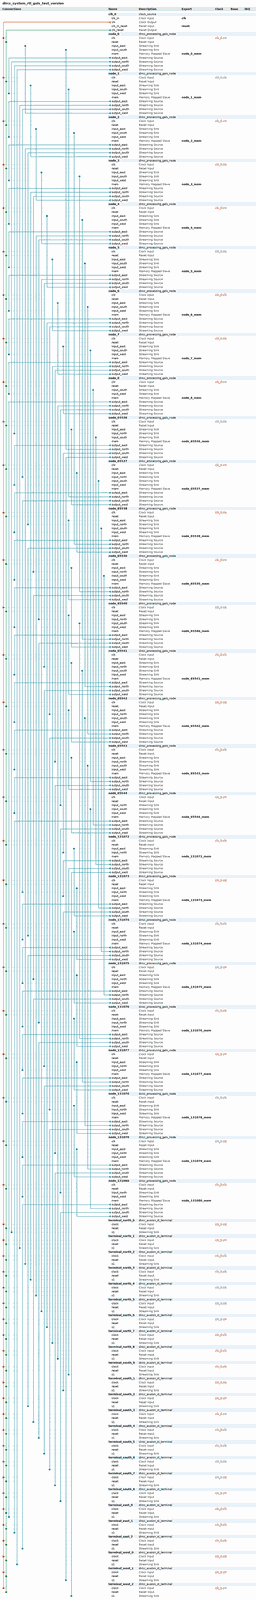
[diagram p0: system contents, whole]
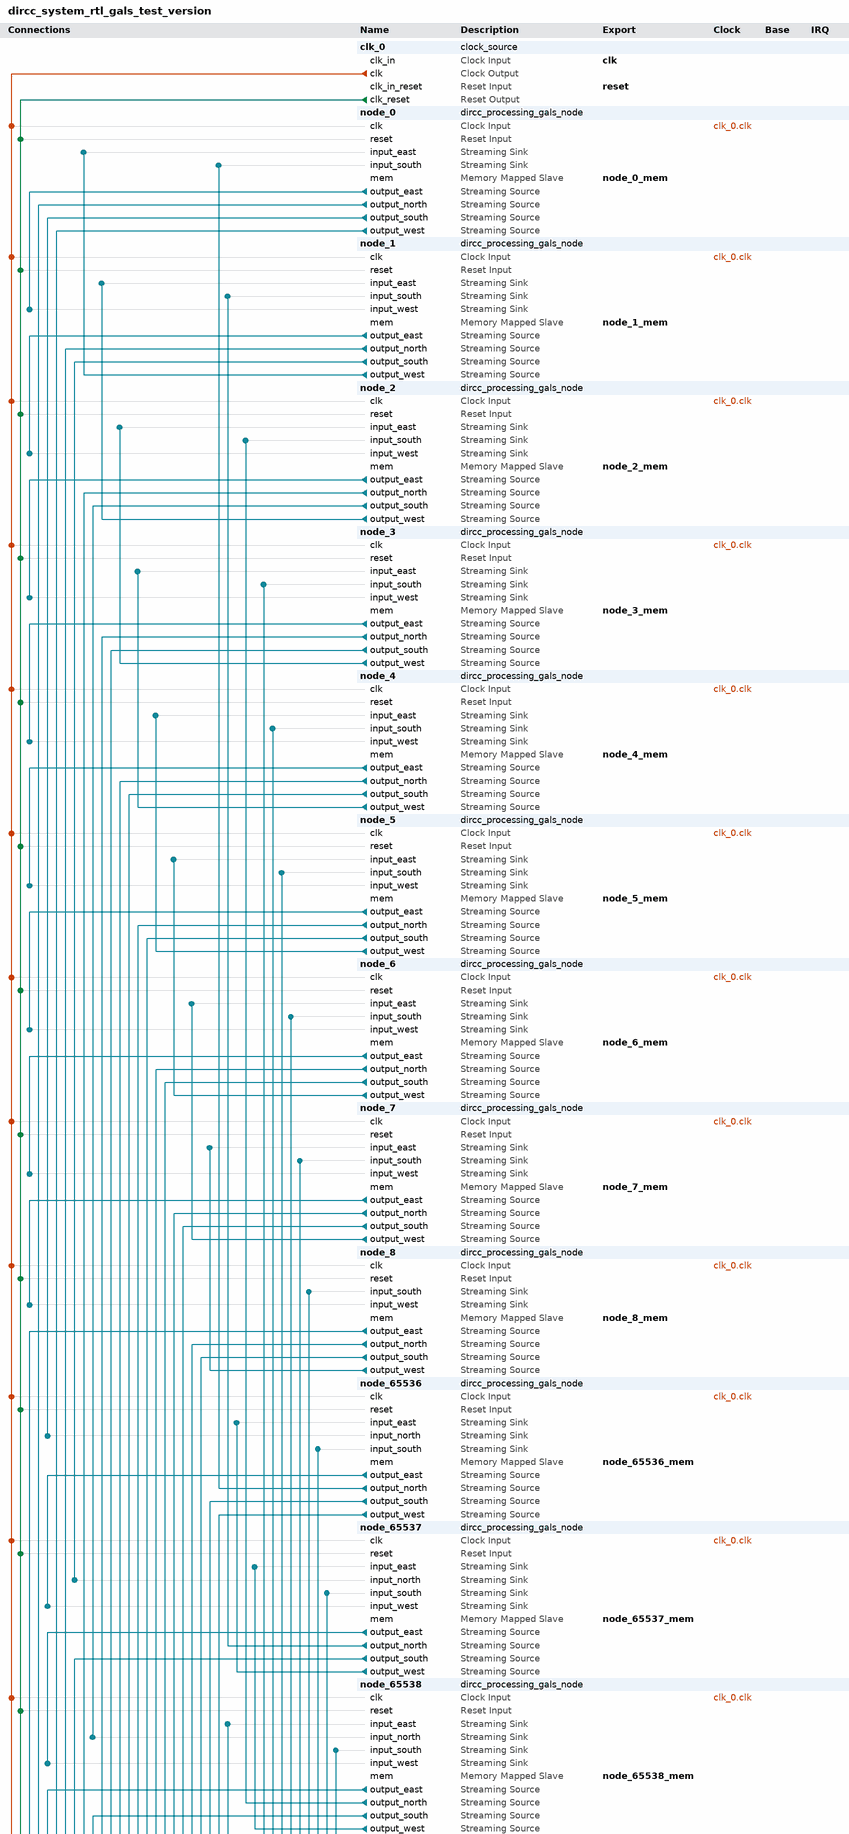
[diagram p1: system contents, upper part]
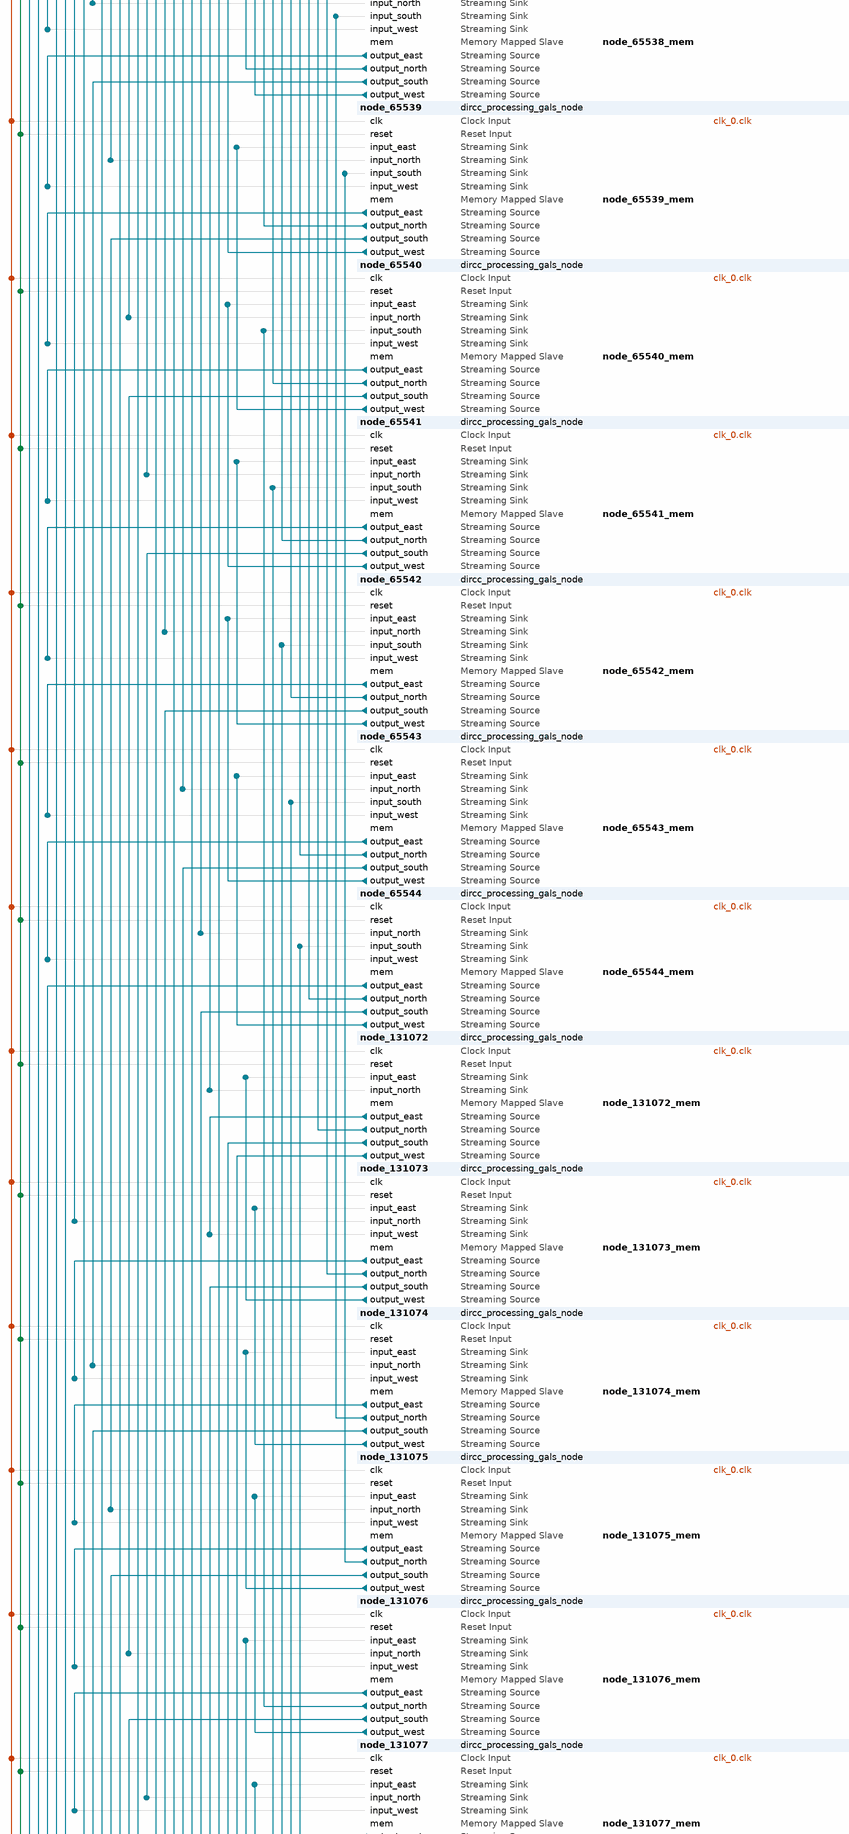
[diagram p2: system contents, middle part]
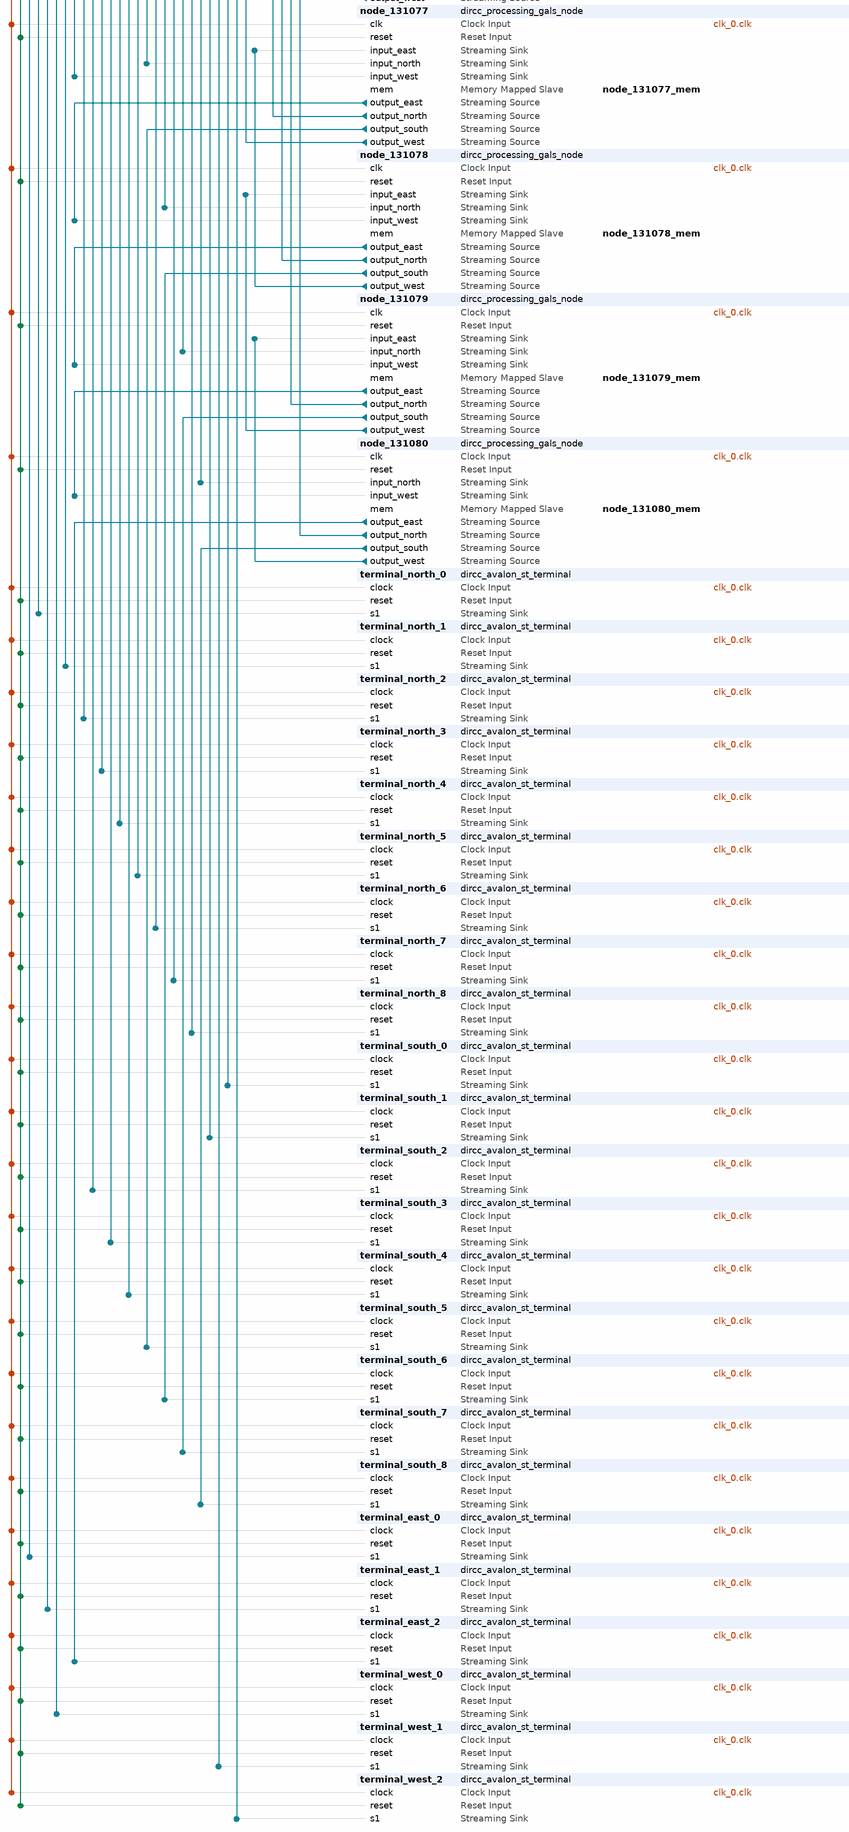
[diagram p3: system contents, lower part]
# Platform Designer (Qsys) system dircc_system_rtl_gals_test_version, Cyclone V 5CSEMA5F31C6
# Parameters at their usual value, and those the tool derives, are not listed.
package require -exact qsys 16.1
create_system dircc_system_rtl_gals_test_version
set_project_property DEVICE_FAMILY {Cyclone V}
set_project_property DEVICE 5CSEMA5F31C6

add_instance clk_0 clock_source 16.1
set_instance_parameter_value clk_0 clockFrequency 50000000

add_instance node_0 dircc_processing_gals_node 1.0
set_instance_parameter_value node_0 ADDRESS 0

add_instance node_1 dircc_processing_gals_node 1.0
set_instance_parameter_value node_1 ADDRESS 1

add_instance node_2 dircc_processing_gals_node 1.0
set_instance_parameter_value node_2 ADDRESS 2

add_instance node_3 dircc_processing_gals_node 1.0
set_instance_parameter_value node_3 ADDRESS 3

add_instance node_4 dircc_processing_gals_node 1.0
set_instance_parameter_value node_4 ADDRESS 4

add_instance node_5 dircc_processing_gals_node 1.0
set_instance_parameter_value node_5 ADDRESS 5

add_instance node_6 dircc_processing_gals_node 1.0
set_instance_parameter_value node_6 ADDRESS 6

add_instance node_7 dircc_processing_gals_node 1.0
set_instance_parameter_value node_7 ADDRESS 7

add_instance node_8 dircc_processing_gals_node 1.0
set_instance_parameter_value node_8 ADDRESS 8

add_instance node_65536 dircc_processing_gals_node 1.0
set_instance_parameter_value node_65536 ADDRESS 65536

add_instance node_65537 dircc_processing_gals_node 1.0
set_instance_parameter_value node_65537 ADDRESS 65537

add_instance node_65538 dircc_processing_gals_node 1.0
set_instance_parameter_value node_65538 ADDRESS 65538

add_instance node_65539 dircc_processing_gals_node 1.0
set_instance_parameter_value node_65539 ADDRESS 65539

add_instance node_65540 dircc_processing_gals_node 1.0
set_instance_parameter_value node_65540 ADDRESS 65540

add_instance node_65541 dircc_processing_gals_node 1.0
set_instance_parameter_value node_65541 ADDRESS 65541

add_instance node_65542 dircc_processing_gals_node 1.0
set_instance_parameter_value node_65542 ADDRESS 65542

add_instance node_65543 dircc_processing_gals_node 1.0
set_instance_parameter_value node_65543 ADDRESS 65543

add_instance node_65544 dircc_processing_gals_node 1.0
set_instance_parameter_value node_65544 ADDRESS 65544

add_instance node_131072 dircc_processing_gals_node 1.0
set_instance_parameter_value node_131072 ADDRESS 131072

add_instance node_131073 dircc_processing_gals_node 1.0
set_instance_parameter_value node_131073 ADDRESS 131073

add_instance node_131074 dircc_processing_gals_node 1.0
set_instance_parameter_value node_131074 ADDRESS 131074

add_instance node_131075 dircc_processing_gals_node 1.0
set_instance_parameter_value node_131075 ADDRESS 131075

add_instance node_131076 dircc_processing_gals_node 1.0
set_instance_parameter_value node_131076 ADDRESS 131076

add_instance node_131077 dircc_processing_gals_node 1.0
set_instance_parameter_value node_131077 ADDRESS 131077

add_instance node_131078 dircc_processing_gals_node 1.0
set_instance_parameter_value node_131078 ADDRESS 131078

add_instance node_131079 dircc_processing_gals_node 1.0
set_instance_parameter_value node_131079 ADDRESS 131079

add_instance node_131080 dircc_processing_gals_node 1.0
set_instance_parameter_value node_131080 ADDRESS 131080

add_instance terminal_north_0 dircc_avalon_st_terminal 1.0
set_instance_parameter_value terminal_north_0 DATA_WIDTH 32

add_instance terminal_north_1 dircc_avalon_st_terminal 1.0
set_instance_parameter_value terminal_north_1 DATA_WIDTH 32

add_instance terminal_north_2 dircc_avalon_st_terminal 1.0
set_instance_parameter_value terminal_north_2 DATA_WIDTH 32

add_instance terminal_north_3 dircc_avalon_st_terminal 1.0
set_instance_parameter_value terminal_north_3 DATA_WIDTH 32

add_instance terminal_north_4 dircc_avalon_st_terminal 1.0
set_instance_parameter_value terminal_north_4 DATA_WIDTH 32

add_instance terminal_north_5 dircc_avalon_st_terminal 1.0
set_instance_parameter_value terminal_north_5 DATA_WIDTH 32

add_instance terminal_north_6 dircc_avalon_st_terminal 1.0
set_instance_parameter_value terminal_north_6 DATA_WIDTH 32

add_instance terminal_north_7 dircc_avalon_st_terminal 1.0
set_instance_parameter_value terminal_north_7 DATA_WIDTH 32

add_instance terminal_north_8 dircc_avalon_st_terminal 1.0
set_instance_parameter_value terminal_north_8 DATA_WIDTH 32

add_instance terminal_south_0 dircc_avalon_st_terminal 1.0
set_instance_parameter_value terminal_south_0 DATA_WIDTH 32

add_instance terminal_south_1 dircc_avalon_st_terminal 1.0
set_instance_parameter_value terminal_south_1 DATA_WIDTH 32

add_instance terminal_south_2 dircc_avalon_st_terminal 1.0
set_instance_parameter_value terminal_south_2 DATA_WIDTH 32

add_instance terminal_south_3 dircc_avalon_st_terminal 1.0
set_instance_parameter_value terminal_south_3 DATA_WIDTH 32

add_instance terminal_south_4 dircc_avalon_st_terminal 1.0
set_instance_parameter_value terminal_south_4 DATA_WIDTH 32

add_instance terminal_south_5 dircc_avalon_st_terminal 1.0
set_instance_parameter_value terminal_south_5 DATA_WIDTH 32

add_instance terminal_south_6 dircc_avalon_st_terminal 1.0
set_instance_parameter_value terminal_south_6 DATA_WIDTH 32

add_instance terminal_south_7 dircc_avalon_st_terminal 1.0
set_instance_parameter_value terminal_south_7 DATA_WIDTH 32

add_instance terminal_south_8 dircc_avalon_st_terminal 1.0
set_instance_parameter_value terminal_south_8 DATA_WIDTH 32

add_instance terminal_east_0 dircc_avalon_st_terminal 1.0
set_instance_parameter_value terminal_east_0 DATA_WIDTH 32

add_instance terminal_east_1 dircc_avalon_st_terminal 1.0
set_instance_parameter_value terminal_east_1 DATA_WIDTH 32

add_instance terminal_east_2 dircc_avalon_st_terminal 1.0
set_instance_parameter_value terminal_east_2 DATA_WIDTH 32

add_instance terminal_west_0 dircc_avalon_st_terminal 1.0
set_instance_parameter_value terminal_west_0 DATA_WIDTH 32

add_instance terminal_west_1 dircc_avalon_st_terminal 1.0
set_instance_parameter_value terminal_west_1 DATA_WIDTH 32

add_instance terminal_west_2 dircc_avalon_st_terminal 1.0
set_instance_parameter_value terminal_west_2 DATA_WIDTH 32

# connections
add_connection clk_0.clk node_0.clk clock
add_connection clk_0.clk node_1.clk clock
add_connection clk_0.clk node_2.clk clock
add_connection clk_0.clk node_3.clk clock
add_connection clk_0.clk node_4.clk clock
add_connection clk_0.clk node_5.clk clock
add_connection clk_0.clk node_6.clk clock
add_connection clk_0.clk node_7.clk clock
add_connection clk_0.clk node_8.clk clock
add_connection clk_0.clk node_65536.clk clock
add_connection clk_0.clk node_65537.clk clock
add_connection clk_0.clk node_65538.clk clock
add_connection clk_0.clk node_65539.clk clock
add_connection clk_0.clk node_65540.clk clock
add_connection clk_0.clk node_65541.clk clock
add_connection clk_0.clk node_65542.clk clock
add_connection clk_0.clk node_65543.clk clock
add_connection clk_0.clk node_65544.clk clock
add_connection clk_0.clk node_131072.clk clock
add_connection clk_0.clk node_131073.clk clock
add_connection clk_0.clk node_131074.clk clock
add_connection clk_0.clk node_131075.clk clock
add_connection clk_0.clk node_131076.clk clock
add_connection clk_0.clk node_131077.clk clock
add_connection clk_0.clk node_131078.clk clock
add_connection clk_0.clk node_131079.clk clock
add_connection clk_0.clk node_131080.clk clock
add_connection clk_0.clk terminal_east_0.clock clock
add_connection clk_0.clk terminal_east_1.clock clock
add_connection clk_0.clk terminal_east_2.clock clock
add_connection clk_0.clk terminal_north_0.clock clock
add_connection clk_0.clk terminal_north_1.clock clock
add_connection clk_0.clk terminal_north_2.clock clock
add_connection clk_0.clk terminal_north_3.clock clock
add_connection clk_0.clk terminal_north_4.clock clock
add_connection clk_0.clk terminal_north_5.clock clock
add_connection clk_0.clk terminal_north_6.clock clock
add_connection clk_0.clk terminal_north_7.clock clock
add_connection clk_0.clk terminal_north_8.clock clock
add_connection clk_0.clk terminal_south_0.clock clock
add_connection clk_0.clk terminal_south_1.clock clock
add_connection clk_0.clk terminal_south_2.clock clock
add_connection clk_0.clk terminal_south_3.clock clock
add_connection clk_0.clk terminal_south_4.clock clock
add_connection clk_0.clk terminal_south_5.clock clock
add_connection clk_0.clk terminal_south_6.clock clock
add_connection clk_0.clk terminal_south_7.clock clock
add_connection clk_0.clk terminal_south_8.clock clock
add_connection clk_0.clk terminal_west_0.clock clock
add_connection clk_0.clk terminal_west_1.clock clock
add_connection clk_0.clk terminal_west_2.clock clock
add_connection clk_0.clk_reset node_0.reset reset
add_connection clk_0.clk_reset node_1.reset reset
add_connection clk_0.clk_reset node_2.reset reset
add_connection clk_0.clk_reset node_3.reset reset
add_connection clk_0.clk_reset node_4.reset reset
add_connection clk_0.clk_reset node_5.reset reset
add_connection clk_0.clk_reset node_6.reset reset
add_connection clk_0.clk_reset node_7.reset reset
add_connection clk_0.clk_reset node_8.reset reset
add_connection clk_0.clk_reset node_65536.reset reset
add_connection clk_0.clk_reset node_65537.reset reset
add_connection clk_0.clk_reset node_65538.reset reset
add_connection clk_0.clk_reset node_65539.reset reset
add_connection clk_0.clk_reset node_65540.reset reset
add_connection clk_0.clk_reset node_65541.reset reset
add_connection clk_0.clk_reset node_65542.reset reset
add_connection clk_0.clk_reset node_65543.reset reset
add_connection clk_0.clk_reset node_65544.reset reset
add_connection clk_0.clk_reset node_131072.reset reset
add_connection clk_0.clk_reset node_131073.reset reset
add_connection clk_0.clk_reset node_131074.reset reset
add_connection clk_0.clk_reset node_131075.reset reset
add_connection clk_0.clk_reset node_131076.reset reset
add_connection clk_0.clk_reset node_131077.reset reset
add_connection clk_0.clk_reset node_131078.reset reset
add_connection clk_0.clk_reset node_131079.reset reset
add_connection clk_0.clk_reset node_131080.reset reset
add_connection clk_0.clk_reset terminal_east_0.reset reset
add_connection clk_0.clk_reset terminal_east_1.reset reset
add_connection clk_0.clk_reset terminal_east_2.reset reset
add_connection clk_0.clk_reset terminal_north_0.reset reset
add_connection clk_0.clk_reset terminal_north_1.reset reset
add_connection clk_0.clk_reset terminal_north_2.reset reset
add_connection clk_0.clk_reset terminal_north_3.reset reset
add_connection clk_0.clk_reset terminal_north_4.reset reset
add_connection clk_0.clk_reset terminal_north_5.reset reset
add_connection clk_0.clk_reset terminal_north_6.reset reset
add_connection clk_0.clk_reset terminal_north_7.reset reset
add_connection clk_0.clk_reset terminal_north_8.reset reset
add_connection clk_0.clk_reset terminal_south_0.reset reset
add_connection clk_0.clk_reset terminal_south_1.reset reset
add_connection clk_0.clk_reset terminal_south_2.reset reset
add_connection clk_0.clk_reset terminal_south_3.reset reset
add_connection clk_0.clk_reset terminal_south_4.reset reset
add_connection clk_0.clk_reset terminal_south_5.reset reset
add_connection clk_0.clk_reset terminal_south_6.reset reset
add_connection clk_0.clk_reset terminal_south_7.reset reset
add_connection clk_0.clk_reset terminal_south_8.reset reset
add_connection clk_0.clk_reset terminal_west_0.reset reset
add_connection clk_0.clk_reset terminal_west_1.reset reset
add_connection clk_0.clk_reset terminal_west_2.reset reset
add_connection node_0.output_east node_1.input_west avalon_streaming
add_connection node_0.output_north terminal_north_0.s1 avalon_streaming
add_connection node_0.output_south node_65536.input_north avalon_streaming
add_connection node_0.output_west terminal_west_0.s1 avalon_streaming
add_connection node_1.output_east node_2.input_west avalon_streaming
add_connection node_1.output_north terminal_north_1.s1 avalon_streaming
add_connection node_1.output_south node_65537.input_north avalon_streaming
add_connection node_1.output_west node_0.input_east avalon_streaming
add_connection node_2.output_east node_3.input_west avalon_streaming
add_connection node_2.output_north terminal_north_2.s1 avalon_streaming
add_connection node_2.output_south node_65538.input_north avalon_streaming
add_connection node_2.output_west node_1.input_east avalon_streaming
add_connection node_3.output_east node_4.input_west avalon_streaming
add_connection node_3.output_north terminal_north_3.s1 avalon_streaming
add_connection node_3.output_south node_65539.input_north avalon_streaming
add_connection node_3.output_west node_2.input_east avalon_streaming
add_connection node_4.output_east node_5.input_west avalon_streaming
add_connection node_4.output_north terminal_north_4.s1 avalon_streaming
add_connection node_4.output_south node_65540.input_north avalon_streaming
add_connection node_4.output_west node_3.input_east avalon_streaming
add_connection node_5.output_east node_6.input_west avalon_streaming
add_connection node_5.output_north terminal_north_5.s1 avalon_streaming
add_connection node_5.output_south node_65541.input_north avalon_streaming
add_connection node_5.output_west node_4.input_east avalon_streaming
add_connection node_6.output_east node_7.input_west avalon_streaming
add_connection node_6.output_north terminal_north_6.s1 avalon_streaming
add_connection node_6.output_south node_65542.input_north avalon_streaming
add_connection node_6.output_west node_5.input_east avalon_streaming
add_connection node_7.output_east node_8.input_west avalon_streaming
add_connection node_7.output_north terminal_north_7.s1 avalon_streaming
add_connection node_7.output_south node_65543.input_north avalon_streaming
add_connection node_7.output_west node_6.input_east avalon_streaming
add_connection node_8.output_east terminal_east_0.s1 avalon_streaming
add_connection node_8.output_north terminal_north_8.s1 avalon_streaming
add_connection node_8.output_south node_65544.input_north avalon_streaming
add_connection node_8.output_west node_7.input_east avalon_streaming
add_connection node_65536.output_east node_65537.input_west avalon_streaming
add_connection node_65536.output_north node_0.input_south avalon_streaming
add_connection node_65536.output_south node_131072.input_north avalon_streaming
add_connection node_65536.output_west terminal_west_1.s1 avalon_streaming
add_connection node_65537.output_east node_65538.input_west avalon_streaming
add_connection node_65537.output_north node_1.input_south avalon_streaming
add_connection node_65537.output_south node_131073.input_north avalon_streaming
add_connection node_65537.output_west node_65536.input_east avalon_streaming
add_connection node_65538.output_east node_65539.input_west avalon_streaming
add_connection node_65538.output_north node_2.input_south avalon_streaming
add_connection node_65538.output_south node_131074.input_north avalon_streaming
add_connection node_65538.output_west node_65537.input_east avalon_streaming
add_connection node_65539.output_east node_65540.input_west avalon_streaming
add_connection node_65539.output_north node_3.input_south avalon_streaming
add_connection node_65539.output_south node_131075.input_north avalon_streaming
add_connection node_65539.output_west node_65538.input_east avalon_streaming
add_connection node_65540.output_east node_65541.input_west avalon_streaming
add_connection node_65540.output_north node_4.input_south avalon_streaming
add_connection node_65540.output_south node_131076.input_north avalon_streaming
add_connection node_65540.output_west node_65539.input_east avalon_streaming
add_connection node_65541.output_east node_65542.input_west avalon_streaming
add_connection node_65541.output_north node_5.input_south avalon_streaming
add_connection node_65541.output_south node_131077.input_north avalon_streaming
add_connection node_65541.output_west node_65540.input_east avalon_streaming
add_connection node_65542.output_east node_65543.input_west avalon_streaming
add_connection node_65542.output_north node_6.input_south avalon_streaming
add_connection node_65542.output_south node_131078.input_north avalon_streaming
add_connection node_65542.output_west node_65541.input_east avalon_streaming
add_connection node_65543.output_east node_65544.input_west avalon_streaming
add_connection node_65543.output_north node_7.input_south avalon_streaming
add_connection node_65543.output_south node_131079.input_north avalon_streaming
add_connection node_65543.output_west node_65542.input_east avalon_streaming
add_connection node_65544.output_east terminal_east_1.s1 avalon_streaming
add_connection node_65544.output_north node_8.input_south avalon_streaming
add_connection node_65544.output_south node_131080.input_north avalon_streaming
add_connection node_65544.output_west node_65543.input_east avalon_streaming
add_connection node_131072.output_east node_131073.input_west avalon_streaming
add_connection node_131072.output_north node_65536.input_south avalon_streaming
add_connection node_131072.output_south terminal_south_0.s1 avalon_streaming
add_connection node_131072.output_west terminal_west_2.s1 avalon_streaming
add_connection node_131073.output_east node_131074.input_west avalon_streaming
add_connection node_131073.output_north node_65537.input_south avalon_streaming
add_connection node_131073.output_south terminal_south_1.s1 avalon_streaming
add_connection node_131073.output_west node_131072.input_east avalon_streaming
add_connection node_131074.output_east node_131075.input_west avalon_streaming
add_connection node_131074.output_north node_65538.input_south avalon_streaming
add_connection node_131074.output_south terminal_south_2.s1 avalon_streaming
add_connection node_131074.output_west node_131073.input_east avalon_streaming
add_connection node_131075.output_east node_131076.input_west avalon_streaming
add_connection node_131075.output_north node_65539.input_south avalon_streaming
add_connection node_131075.output_south terminal_south_3.s1 avalon_streaming
add_connection node_131075.output_west node_131074.input_east avalon_streaming
add_connection node_131076.output_east node_131077.input_west avalon_streaming
add_connection node_131076.output_north node_65540.input_south avalon_streaming
add_connection node_131076.output_south terminal_south_4.s1 avalon_streaming
add_connection node_131076.output_west node_131075.input_east avalon_streaming
add_connection node_131077.output_east node_131078.input_west avalon_streaming
add_connection node_131077.output_north node_65541.input_south avalon_streaming
add_connection node_131077.output_south terminal_south_5.s1 avalon_streaming
add_connection node_131077.output_west node_131076.input_east avalon_streaming
add_connection node_131078.output_east node_131079.input_west avalon_streaming
add_connection node_131078.output_north node_65542.input_south avalon_streaming
add_connection node_131078.output_south terminal_south_6.s1 avalon_streaming
add_connection node_131078.output_west node_131077.input_east avalon_streaming
add_connection node_131079.output_east node_131080.input_west avalon_streaming
add_connection node_131079.output_north node_65543.input_south avalon_streaming
add_connection node_131079.output_south terminal_south_7.s1 avalon_streaming
add_connection node_131079.output_west node_131078.input_east avalon_streaming
add_connection node_131080.output_east terminal_east_2.s1 avalon_streaming
add_connection node_131080.output_north node_65544.input_south avalon_streaming
add_connection node_131080.output_south terminal_south_8.s1 avalon_streaming
add_connection node_131080.output_west node_131079.input_east avalon_streaming

# exported interfaces
add_interface clk clock sink
set_interface_property clk EXPORT_OF clk_0.clk_in
add_interface node_0_mem avalon slave
set_interface_property node_0_mem EXPORT_OF node_0.mem
add_interface node_131072_mem avalon slave
set_interface_property node_131072_mem EXPORT_OF node_131072.mem
add_interface node_131073_mem avalon slave
set_interface_property node_131073_mem EXPORT_OF node_131073.mem
add_interface node_131074_mem avalon slave
set_interface_property node_131074_mem EXPORT_OF node_131074.mem
add_interface node_131075_mem avalon slave
set_interface_property node_131075_mem EXPORT_OF node_131075.mem
add_interface node_131076_mem avalon slave
set_interface_property node_131076_mem EXPORT_OF node_131076.mem
add_interface node_131077_mem avalon slave
set_interface_property node_131077_mem EXPORT_OF node_131077.mem
add_interface node_131078_mem avalon slave
set_interface_property node_131078_mem EXPORT_OF node_131078.mem
add_interface node_131079_mem avalon slave
set_interface_property node_131079_mem EXPORT_OF node_131079.mem
add_interface node_131080_mem avalon slave
set_interface_property node_131080_mem EXPORT_OF node_131080.mem
add_interface node_1_mem avalon slave
set_interface_property node_1_mem EXPORT_OF node_1.mem
add_interface node_2_mem avalon slave
set_interface_property node_2_mem EXPORT_OF node_2.mem
add_interface node_3_mem avalon slave
set_interface_property node_3_mem EXPORT_OF node_3.mem
add_interface node_4_mem avalon slave
set_interface_property node_4_mem EXPORT_OF node_4.mem
add_interface node_5_mem avalon slave
set_interface_property node_5_mem EXPORT_OF node_5.mem
add_interface node_65536_mem avalon slave
set_interface_property node_65536_mem EXPORT_OF node_65536.mem
add_interface node_65537_mem avalon slave
set_interface_property node_65537_mem EXPORT_OF node_65537.mem
add_interface node_65538_mem avalon slave
set_interface_property node_65538_mem EXPORT_OF node_65538.mem
add_interface node_65539_mem avalon slave
set_interface_property node_65539_mem EXPORT_OF node_65539.mem
add_interface node_65540_mem avalon slave
set_interface_property node_65540_mem EXPORT_OF node_65540.mem
add_interface node_65541_mem avalon slave
set_interface_property node_65541_mem EXPORT_OF node_65541.mem
add_interface node_65542_mem avalon slave
set_interface_property node_65542_mem EXPORT_OF node_65542.mem
add_interface node_65543_mem avalon slave
set_interface_property node_65543_mem EXPORT_OF node_65543.mem
add_interface node_65544_mem avalon slave
set_interface_property node_65544_mem EXPORT_OF node_65544.mem
add_interface node_6_mem avalon slave
set_interface_property node_6_mem EXPORT_OF node_6.mem
add_interface node_7_mem avalon slave
set_interface_property node_7_mem EXPORT_OF node_7.mem
add_interface node_8_mem avalon slave
set_interface_property node_8_mem EXPORT_OF node_8.mem
add_interface reset reset sink
set_interface_property reset EXPORT_OF clk_0.clk_in_reset

set_interconnect_requirement {$system} qsys_mm.clockCrossingAdapter HANDSHAKE
set_interconnect_requirement {$system} qsys_mm.enableEccProtection FALSE
set_interconnect_requirement {$system} qsys_mm.insertDefaultSlave FALSE
set_interconnect_requirement {$system} qsys_mm.maxAdditionalLatency 1

save_system dircc_system_rtl_gals_test_version.qsys
